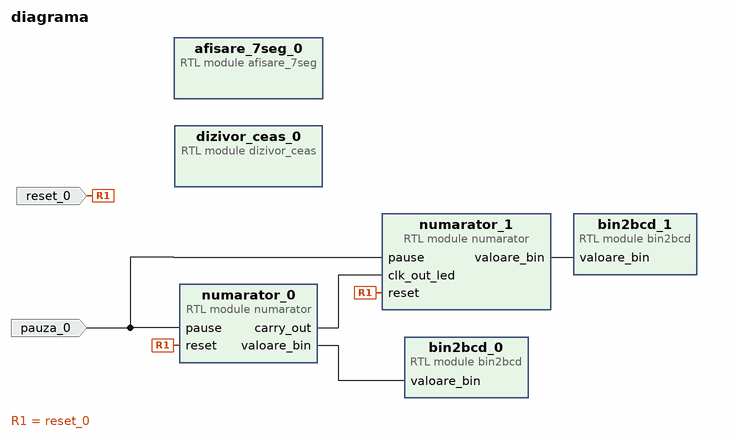
[diagram p0: block diagram of the top level]
# Vivado block design diagrama, xc7a100tcsg324-1, Vivado 2021.1
create_bd_design diagrama

create_bd_port -dir I pauza_0
create_bd_port -dir I -type rst reset_0

create_bd_cell -type module -reference bin2bcd bin2bcd_0
create_bd_cell -type module -reference bin2bcd bin2bcd_1
create_bd_cell -type module -reference dizivor_ceas dizivor_ceas_0
create_bd_cell -type module -reference afisare_7seg afisare_7seg_0
create_bd_cell -type module -reference numarator numarator_0
create_bd_cell -type module -reference numarator numarator_1

# ---- connections ----

connect_bd_net [get_bd_pins numarator_0/carry_out] [get_bd_pins numarator_1/clk_out_led]
connect_bd_net [get_bd_pins numarator_0/valoare_bin] [get_bd_pins bin2bcd_0/valoare_bin]
connect_bd_net [get_bd_pins numarator_1/valoare_bin] [get_bd_pins bin2bcd_1/valoare_bin]
connect_bd_net -net pauza_0_1 [get_bd_ports pauza_0] [get_bd_pins numarator_0/pause] [get_bd_pins numarator_1/pause]
connect_bd_net -net reset_0_1 [get_bd_ports reset_0] [get_bd_pins numarator_0/reset] [get_bd_pins numarator_1/reset]

validate_bd_design
save_bd_design
